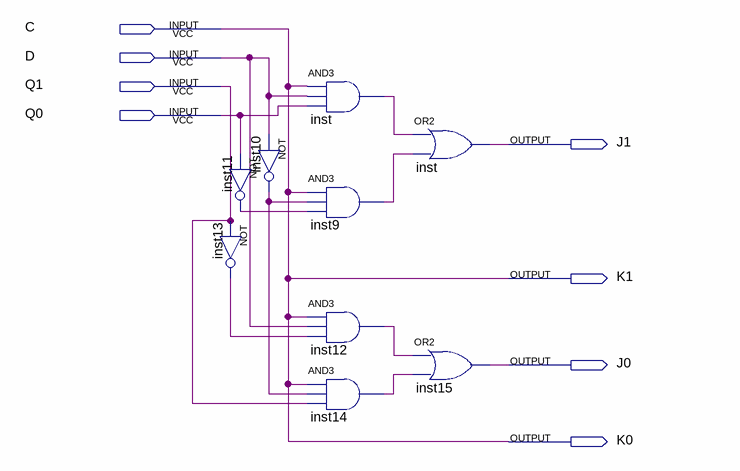
[diagram p0: schematic sheet]
// Quartus schematic MOD_3_JKFF_ENCONDING_3.bdf as structural Verilog: 9 symbols, 8 pins
module MOD_3_JKFF_ENCONDING_3 (
  input  C,
  input  D,
  input  Q1,
  input  Q0,
  output J1,
  output K1,
  output J0,
  output K0
);

  wire inst9_out, inst10_out, inst11_out, inst12_out, inst13_out, inst14_out, inst_out;

  not inst11 (inst11_out, Q0);
  not inst13 (inst13_out, Q1);
  and inst (inst_out, C, D, Q0);
  not inst10 (inst10_out, D);
  and inst9 (inst9_out, C, inst10_out, inst11_out);
  and inst12 (inst12_out, C, D, inst13_out);
  and inst14 (inst14_out, C, inst10_out, Q1);
  or inst_dup2 (J1, inst_out, inst9_out);
  or inst15 (J0, inst12_out, inst14_out);

  assign K0 = C;
  assign K1 = C;
endmodule
